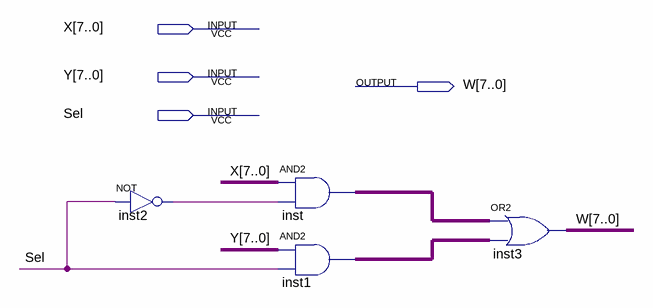
[diagram p0: schematic sheet]
// Quartus schematic MUX21.bdf as structural Verilog: 4 symbols, 4 pins
module MUX21 (
  input  [7:0] X,
  input  [7:0] Y,
  input  Sel,
  output [7:0] W
);

  wire inst2_out;
  wire [7:0] inst1_out, inst_out;

  not inst2 (inst2_out, Sel);
  assign inst_out = X & {8{inst2_out}};  // AND2 inst, 8 bits wide
  assign inst1_out = Y & {8{Sel}};  // AND2 inst1, 8 bits wide
  assign W = inst_out | inst1_out;  // OR2 inst3, 8 bits wide
endmodule
